# EAGLE design Apogee (EAGLE 9.6.2)
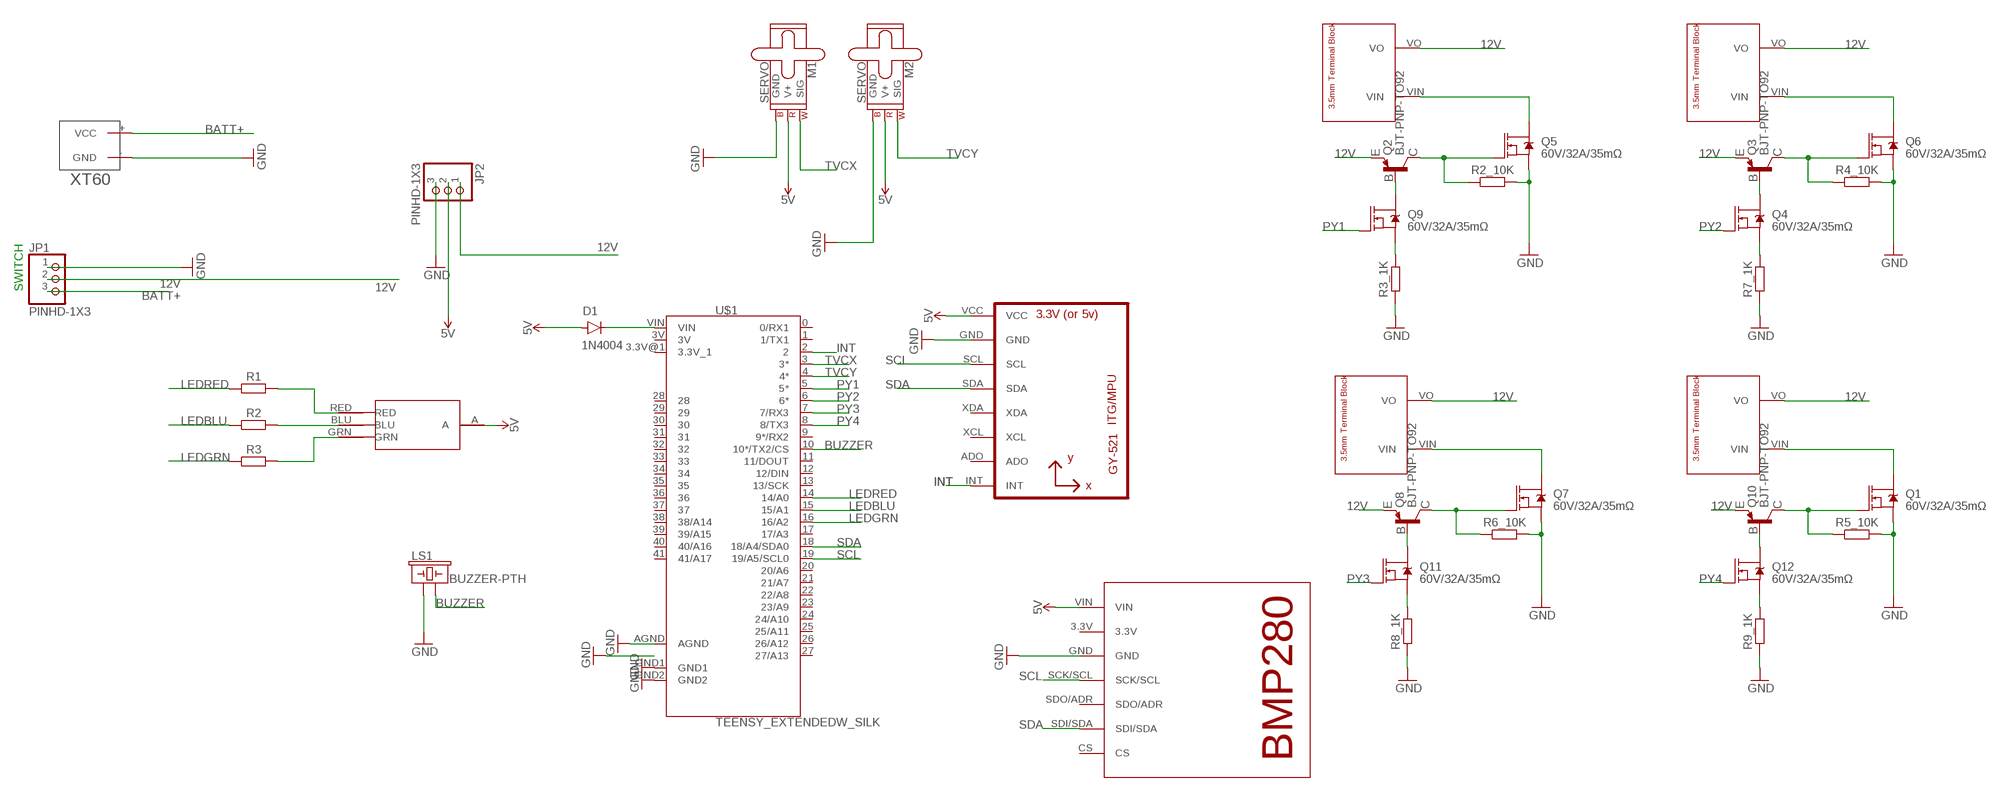
[diagram p0: schematic, sheet 1]

## Parts
D1  1N4004  [DO-41]
JP1  PINHD-1X3  [1X03]
JP2  PINHD-1X3  [1X03]
LS1  BUZZER-PTH  [BUZZER-12MM]
M1  SERVO  [1X03]
M2  SERVO  [1X03]
Q1  60V/32A/35mΩ  MOSFET-NCH-FQP30N06L  [TO220V]
Q2  BJT-PNP-TO92  [TO92]
Q3  BJT-PNP-TO92  [TO92]
Q4  60V/32A/35mΩ  MOSFET-NCH-FQP30N06L  [TO220V]
Q5  60V/32A/35mΩ  MOSFET-NCH-FQP30N06L  [TO220V]
Q6  60V/32A/35mΩ  MOSFET-NCH-FQP30N06L  [TO220V]
Q7  60V/32A/35mΩ  MOSFET-NCH-FQP30N06L  [TO220V]
Q8  BJT-PNP-TO92  [TO92]
Q9  60V/32A/35mΩ  MOSFET-NCH-FQP30N06L  [TO220V]
Q10  BJT-PNP-TO92  [TO92]
Q11  60V/32A/35mΩ  MOSFET-NCH-FQP30N06L  [TO220V]
Q12  60V/32A/35mΩ  MOSFET-NCH-FQP30N06L  [TO220V]
R1  R_AXIAL-7.2MM-PITCH  [RESAD724W46L381D178B]
R2  R_AXIAL-7.2MM-PITCH  [RESAD724W46L381D178B]
R2_10K  R_AXIAL-7.2MM-PITCH  [RESAD724W46L381D178B]
R3  R_AXIAL-7.2MM-PITCH  [RESAD724W46L381D178B]
R3_1K  R_AXIAL-7.2MM-PITCH  [RESAD724W46L381D178B]
R4_10K  R_AXIAL-7.2MM-PITCH  [RESAD724W46L381D178B]
R5_10K  R_AXIAL-7.2MM-PITCH  [RESAD724W46L381D178B]
R6_10K  R_AXIAL-7.2MM-PITCH  [RESAD724W46L381D178B]
R7_1K  R_AXIAL-7.2MM-PITCH  [RESAD724W46L381D178B]
R8_1K  R_AXIAL-7.2MM-PITCH  [RESAD724W46L381D178B]
R9_1K  R_AXIAL-7.2MM-PITCH  [RESAD724W46L381D178B]
U1  GY-521MPU6050  [GY-521]
U$1  TEENSY_EXTENDEDW_SILK  [TEENSY_EXTENDED]
U$2  BMP280  [BMP280]
U$3  XT60  [XT60]
U$4  TERMINALBLOCK  [TERMINALBLOCK]
U$5  LEDCA  [LEDCA]
U$6  TERMINALBLOCK  [TERMINALBLOCK]
U$9  TERMINALBLOCK  [TERMINALBLOCK]
U$10  TERMINALBLOCK  [TERMINALBLOCK]

## Nets
5V: D1.A JP2.2 M1.2(V+) M2.2(V+) U1.VCC U$2.VIN U$5.A
12V: JP1.2 JP2.1 Q2.3(E) Q3.3(E) Q8.3(E) Q10.3(E) U$4.VO U$6.VO U$9.VO U$10.VO
BATT+: JP1.3 U$3.+(VCC)
BUZZER: LS1.- U$1.10(10*/TX2/CS)
GND: JP1.1 JP2.3 LS1.+ M1.3(GND) M2.3(GND) Q1.3(S) Q5.3(S) Q6.3(S) Q7.3(S) R2_10K.2 R3_1K.1 R4_10K.2 R5_10K.2 R6_10K.2 R7_1K.1 R8_1K.1 R9_1K.1 U1.GND U$1.GND1 U$1.GND2 U$2.GND U$3.-(GND)
INT: U1.INT U$1.2
LEDBLU: R2.1 U$1.15(15/A1)
LEDGRN: R3.1 U$1.16(16/A2)
LEDRED: R1.1 U$1.14(14/A0)
N$1: R3.2 U$5.GRN
N$2: R2.2 U$5.BLU
N$3: R1.2 U$5.RED
N$4: Q1.2(D) U$4.VIN
N$5: D1.C U$1.VIN
N$6: U$1.AGND ; supply symbol labelled GND
N$8: Q5.2(D) U$6.VIN
N$9: Q2.2(B) Q9.2(D)
N$10: Q6.2(D) U$9.VIN
N$13: Q7.2(D) U$10.VIN
N$14: Q9.3(S) R3_1K.2
N$15: Q7.1(G) Q8.1(C) R6_10K.1
N$16: Q2.1(C) Q5.1(G) R2_10K.1
N$17: Q1.1(G) Q10.1(C) R5_10K.1
N$18: Q3.1(C) Q6.1(G) R4_10K.1
N$19: Q11.3(S) R8_1K.2
N$20: Q12.3(S) R9_1K.2
N$21: Q4.3(S) R7_1K.2
N$22: Q3.2(B) Q4.2(D)
N$23: Q8.2(B) Q11.2(D)
N$24: Q10.2(B) Q12.2(D)
PY1: Q9.1(G) U$1.5(5*)
PY2: Q4.1(G) U$1.6(6*)
PY3: Q11.1(G) U$1.7(7/RX3)
PY4: Q12.1(G) U$1.8(8/TX3)
SCL: U1.SCL U$1.19(19/A5/SCL0) U$2.SCK/SCL
SDA: U1.SDA U$1.18(18/A4/SDA0) U$2.SDI/SDA
TVCX: M1.1(SIG) U$1.3(3*)
TVCY: M2.1(SIG) U$1.4(4*)
Unconnected: U1.ADO U1.XCL U1.XDA U$1.0(0/RX1) U$1.1(1/TX1) U$1.9(9*/RX2) U$1.11(11/DOUT) U$1.12(12/DIN) U$1.13(13/SCK) U$1.17(17/A3) U$1.20(20/A6) U$1.21(21/A7) U$1.22(22/A8) U$1.23(23/A9) U$1.24(24/A10) U$1.25(25/A11) U$1.26(26/A12) U$1.27(27/A13) U$1.28 U$1.29 U$1.30 U$1.31 U$1.32 U$1.33 U$1.34 U$1.35 U$1.36 U$1.37 U$1.38(38/A14) U$1.39(39/A15) U$1.40(40/A16) U$1.41(41/A17) U$2.3.3V U$2.CS U$2.SDO/ADR

## Notes on the sheet
- SWITCH

## Power pins joined to a net without a drawn wire
3.3V_1: U$1.3.3V@1(3.3V_1)
3V: U$1.3V

## Library data of the parts
D1 = Diodes:1N4004: DIODE GEN PURP 400V 1A DO41 Manufacturer's datasheet <https://www.mccsemi.com/pdf/Products/1N4001-1N4007(DO-41).pdf>; CREATED_BY: PCBLayout.com; DIGIKEY_PART_NUMBER: 1N4004MSCT-ND; MANUFACTURER: Micro Commercial Co; MPN: 1N4004; PACKAGE: DO-41
JP1 JP2 = SwitchROBIN:PINHD-1X3: PIN HEADER; CATEGORY: CONNECTOR; SUB-CATEGORY: PIN-HEADER
LS1 = SparkFun-Electromechanical:BUZZER: Buzzer Small round buzzers that operate around the audible 2kHz range. You can use these as speakers to create simple music or user interfaces. Variant Overview: PTH - Mini Speaker - PC Mount 12mm 2.048kHz <https://www.sparkfun.com/products/7950> PTH_KIT - Mini Speaker - PC Mount 12mm 2.048kHz <https://www.sparkfun.com/products/7950> KIT simplifies soldering by adding stop mask to one side of the pads. PTH_NO_SILK - Mini Speaker - PC Mount 12mm 2.048kHz <https://www.sparkfun.com/products/7950> No silkscreen indicator of buzzer outline. PTH_KIT_NO_SILK - Mini Speaker - PC Mount 12mm 2.048kHz <https://www.sparkfun.com/products/7950> KIT package w/o silkscreen SMD - Buzzer Audio Magnetic (CCV-084B16) SMD buzzer used on, e.g. the LilyPad Buzzer <https://www.sparkfun.com/products/8463> and RFID USB Reader <https://www.sparkfun.com/products/9963>. SMD_KIT - Buzzer Audio Magnetic (CCV-084B16) SMD Buzzer with elongated pins to make soldering easier. Used on the SparkFun Simon Says - Surface Mount Soldering Kit <https://www.sparkfun.com/products/10935>.; PROD_ID: COMP-08253; SF_SKU: COM-07950
M1 M2 = SparkFun-Electromechanical:SERVO: Servo Motor 3-pin connector for a standard servo motor (voltage supply, ground, and control signal.) SparkFun Products Servo - Generic (Sub-Micro Size) <https://www.sparkfun.com/products/9065> (ROB-09065) Servo - Generic High Torque Continuous Rotation (Standard Size) <https://www.sparkfun.com/products/9347> (ROB-09347) Servo - Generic High Torque (Standard Size) <https://www.sparkfun.com/products/11965> (ROB-11965)
Q1 Q4-Q7 Q9 Q11 Q12 = SparkFun-DiscreteSemi:MOSFET-NCH: N-channel MOSFETs Voltage controlled devices that allow control of high current outputs. SparkFun Products: SparkFun OpenScale <https://www.sparkfun.com/products/13261> SparkFun Digital Sandbox <https://www.sparkfun.com/products/12651> SparkFun Monster Moto Shield <https://www.sparkfun.com/products/10182> SparkFun MOSFET Power Controller <https://www.sparkfun.com/products/11214>; PROD_ID: TRANS-10060
Q2 Q3 Q8 Q10 = bt_transistor:BJT-PNP: PNP Transistor Small signal PNP Bipolar Junction Transistor (BJT). Use this device to represent any of a number of such transistors with similar package and pinout: 2N4402, 2N3906, etc.
R1 R2 R2_10K R3 R3_1K R4_10K R5_10K R6_10K R7_1K R8_1K R9_1K = Resistor AHHH3:R: Resistor Fixed - Generic; CATEGORY: Resistor; SUB-CATEGORY: Fixed
U1 = gy-521:GY-521
U$1 = SparkFun-Boards:TEENSY_EXTENDED: Teensy Footprint Extended Mechanical footprint with connectors for Teensy Development Board with ARM Cortex. SparkFun Products: Teensy 4.1 <https://www.sparkfun.com/products/16771> Teensy 3.6 <https://www.sparkfun.com/products/14057> Teensy 3.5 <https://www.sparkfun.com/products/14055> SparkFun Qwiic Shield for Teensy Extended <https://www.sparkfun.com/products/17156> Teensy Stackable Header Kit (Longer Version) <https://www.sparkfun.com/products/17152>
U$2 = BMP280:BMP280
U$3 = XT60:XT60: XT60
U$4 U$6 U$9 U$10 = Terminal Block 2 pins 3.5mm:TERMINALBLOCK
U$5 = LEDCA:LEDCA

## Board
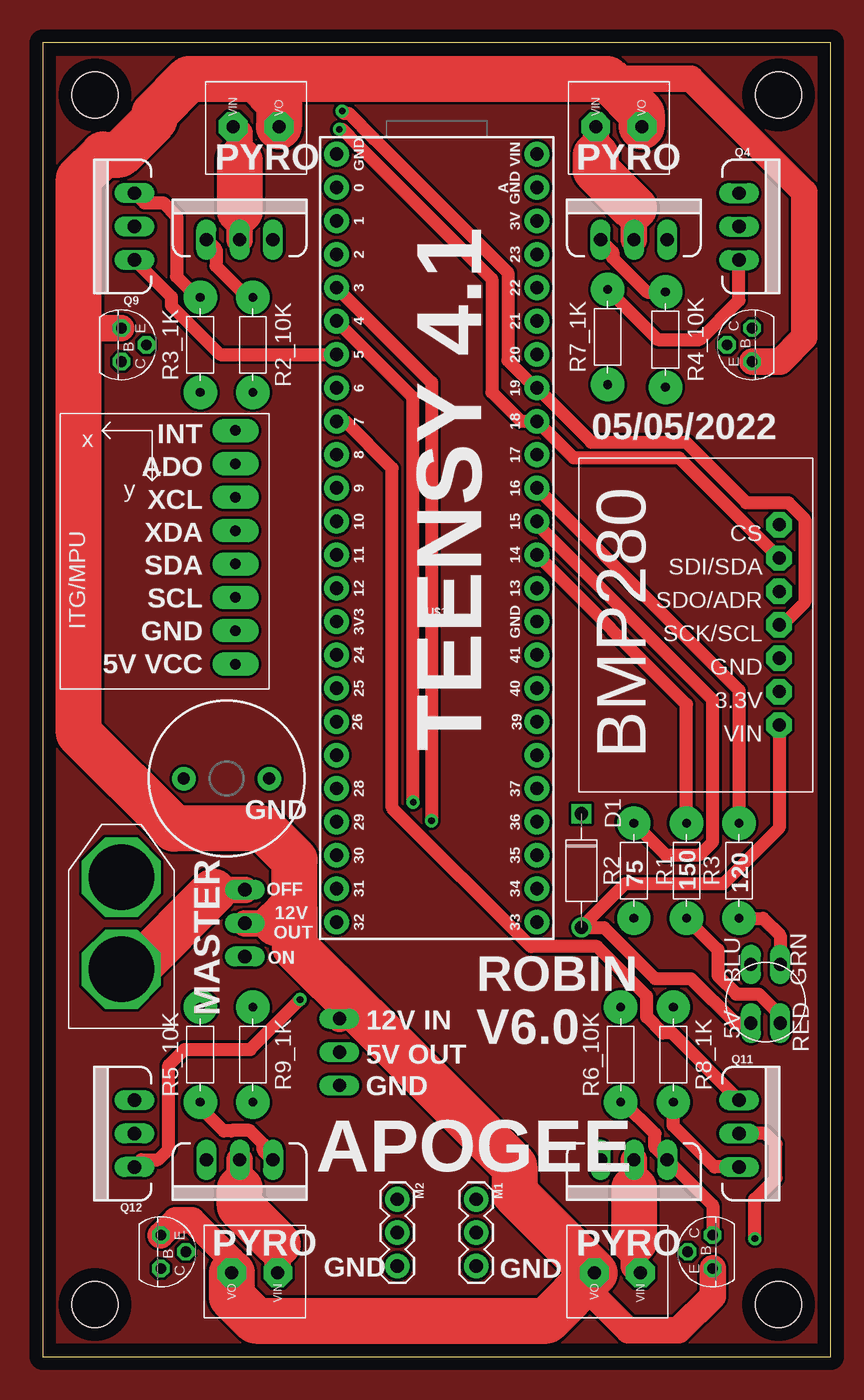
[diagram p1: board, top side]
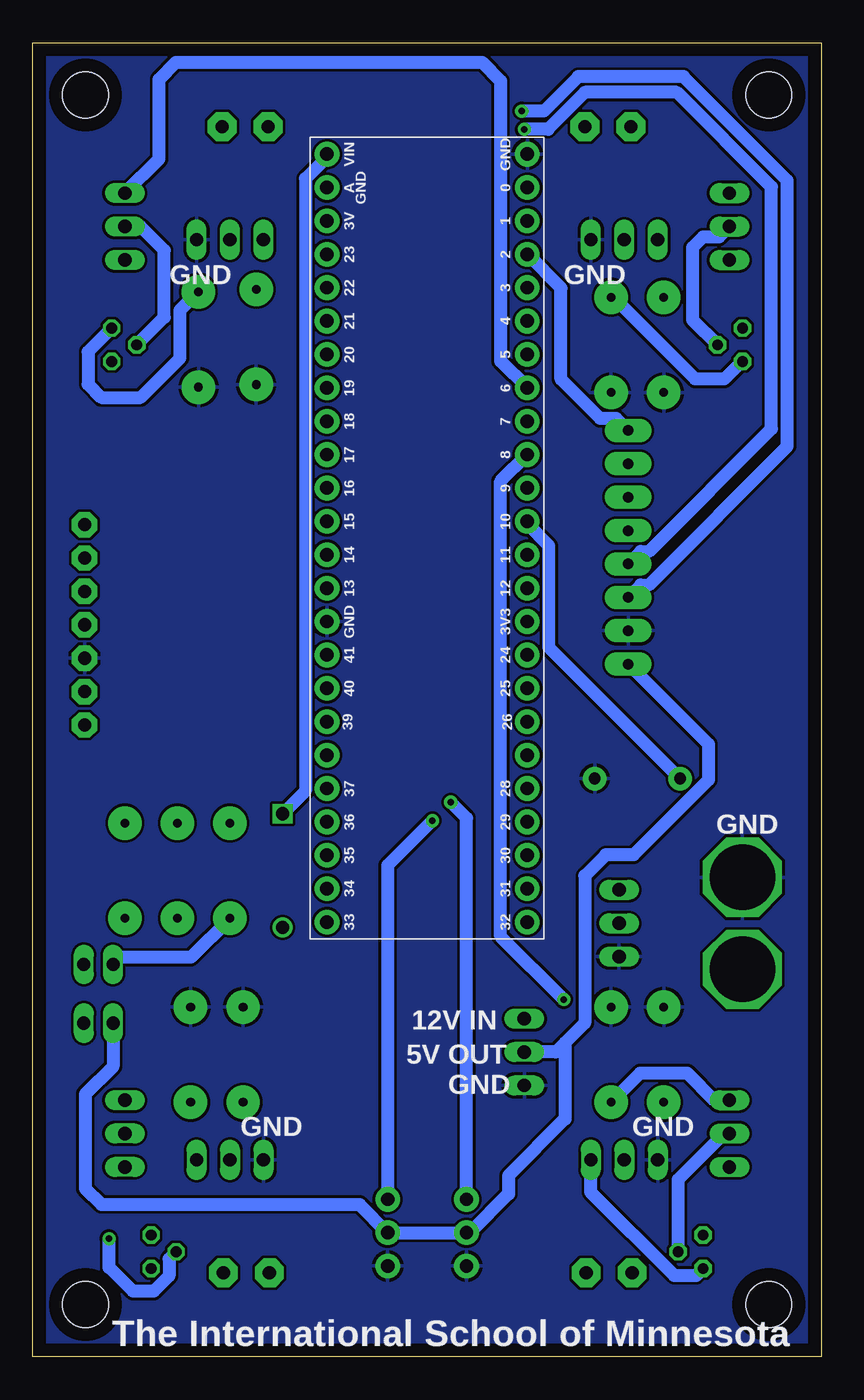
[diagram p2: board, bottom side, seen from below]

Size 60 x 100 mm. Coordinates in mm from the lower left corner, seen from the top.
Outline: 0,100 0,0 60,0 60,100 0,100
Copper layers (1*16): Top 0.035mm / dielectric 1.5mm / Bottom 0.035mm
Design rules "default *": minimum track width 6mil, minimum drill 0.3mm, track to track 8mil, track to pad 8mil, pad to pad 6mil, via to via 6mil, smd to smd 6mil, copper to edge 40mil, drill to drill 6mil, minimum pad ring 10mil, minimum via ring 8mil, stop-mask expansion 4mil, vias tented up to drill 0mil, thermal gap 10mil
Holes 3.5 mm at 4,4 56,4 4,96 56,96

### Footprints (pad centres in the part's own frame; a part is rotated, then mirrored left to right if it is on the bottom)
DO-41 = drill 1: A 4.325,0 | drill 1 square: C -4.325,0
1X03 = drill 1.016 long: 1 -2.54,0; 2 0,0; 3 2.54,0
BUZZER-12MM = drill 0.9 pad 1.778: + 3.25,0; - -3.25,0
1X03' = drill 1.016 pad 1.88: 1 0,0; 2 2.54,0; 3 5.08,0
TO220V = drill 1.016 long: 1 -2.54,0; 2 0,0; 3 2.54,0
TO92 = drill 0.813 octagon: 1 1.27,0; 2 0,1.905; 3 -1.27,0
RESAD724W46L381D178B = drill 0.66 pad 2.54: 1 -3.62,0; 2 3.62,0
GY-521 = drill 0.8 pad 1.778 long: ADO -8.89,-6.35; GND -8.89,6.35; INT -8.89,-8.89; SCL -8.89,3.81; SDA -8.89,1.27; VCC -8.89,8.89; XCL -8.89,-3.81; XDA -8.89,-1.27
TEENSY_EXTENDED = drill 1.016 pad 1.88: 0 7.62,-13.97; 1 7.62,-11.43; 2 7.62,-8.89; 3 7.62,-6.35; 3.3V@1 7.62,19.05; 3V -7.62,-11.43; 4 7.62,-3.81; 5 7.62,-1.27; 6 7.62,1.27; 7 7.62,3.81; 8 7.62,6.35; 9 7.62,8.89; 10 7.62,11.43; 11 7.62,13.97; 12 7.62,16.51; 13 -7.62,16.51; 14 -7.62,13.97; 15 -7.62,11.43; 16 -7.62,8.89; 17 -7.62,6.35; 18 -7.62,3.81; 19 -7.62,1.27; 20 -7.62,-1.27; 21 -7.62,-3.81; 22 -7.62,-6.35; 23 -7.62,-8.89; 24 7.62,21.59; 25 7.62,24.13; 26 7.62,26.67; 27 7.62,29.21; 28 7.62,31.75; 29 7.62,34.29; 30 7.62,36.83; 31 7.62,39.37; 32 7.62,41.91; 33 -7.62,41.91; 34 -7.62,39.37; 35 -7.62,36.83; 36 -7.62,34.29; 37 -7.62,31.75; 38 -7.62,29.21; 39 -7.62,26.67; 40 -7.62,24.13; 41 -7.62,21.59; AGND -7.62,-13.97; GND1 7.62,-16.51; GND2 -7.62,19.05; VIN -7.62,-16.51
BMP280 = drill 1 pad 1.93 octagon: 3.3V 7.62,2.54; CS 20.32,2.54; GND 10.16,2.54; SCK/SCL 12.7,2.54; SDI/SDA 17.78,2.54; SDO/ADR 15.24,2.54; VIN 5.08,2.54
XT60 = drill 5 octagon: + 4.5,0; - 11.5,0
TERMINALBLOCK = drill 1 pad 2.184 octagon: VIN 2.1,3.6; VO 5.6,3.6
LEDCA = drill 1 long: A -1.1,-1.6; BLU -1.1,2.87; GRN 1.13,2.87; RED 1.13,-1.6

### Placement (x,y rotation side)
D1  41,37 270 top
JP1  15.4,33 90 top
JP2  22.6,23.2 270 top
LS1  14,44 0 top
M1  SERVO  [1X03']  33,12 270 top
M2  SERVO  [1X03']  27,12 270 top
Q1  15,15 180 top
Q2  6,77 270 top
Q3  54,77 90 top
Q4  53,86 270 top
Q5  15,85 0 top
Q6  45,85 0 top
Q7  45,15 180 top
Q8  51,8 90 top
Q9  7,86 90 top
Q10  9,8 270 top
Q11  53,17 270 top
Q12  7,17 90 top
R1  49,37 270 top
R2  45,37 270 top
R2_10K  16,77 270 top
R3  53,37 270 top
R3_1K  12,77 90 top
R4_10K  47.4,77.4 270 top
R5_10K  12,23 90 top
R6_10K  44,23 90 top
R7_1K  43,77.6 90 top
R8_1K  48,23 270 top
R9_1K  16,23 270 top
U1  5.8,61.6 180 top
U$1  30,75 180 top
U$2  58.6,43 90 top
U$3  6,25 90 top
U$4  20,10 180 top
U$5  55,27 0 top
U$6  12.4,90 0 top
U$9  40,90 0 top
U$10  47.6,10 180 top

### Tracks (layer width: path | path; a pad name or v marks a point on that pad's centre or on a via)
3.3V
  pour Top: -6,104 65.8,104 65.8,-5 -3,-5 -6,-2
5V
  Top 1: U$5.A 52.7,25.4 49.3,28.8 46.6,28.8 42.73,32.67 D1.A 44.33,36 51.8,36 56.06,40.26 U$2.VIN
  Bottom 1: U$5.A 53.9,22.1 56,20 56,12.8 54.8,11.6 35.14,11.6 M1.2 M2.2 26.74,9.46 23.8,12.4 23.8,13.8 19.5,18.1 19.5,23.9 | U1.VCC 8.6,46.62 8.6,43.9 14.3,38.2 16.4,38.2 18,36.6 18,25.4 19.5,23.9 | JP2.2 20.2,23.2 19.5,23.9
12V
  Top 2: Q10.3 10.13,10.4 11.4,10.4 14.4,7.4 U$4.VO | Q8.3 51,4.62 48.4,2.02 44.58,2.02 42,4.6 U$10.VO | 2.77,78.2 2.84,78.27 Q2.3 | Q3.3 56.13,75.73 57.98,77.58 57.98,88.6 49.35,97.23 42.97,97.23 | JP1.2 17.8,33 | JP2.1 22.77,25.91 24.49,25.91
  Top 3.5: U$4.VO 14.4,4.57 16.2,2.77 38.37,2.77 U$10.VO 35.89,12.51 35.89,14.51 24.49,25.91 19.2,31.2 19.2,34 | 16.2,97.23 18,95.43 U$6.VO | 16.2,97.23 11.15,97.23 8.52,94.6 8.52,94.13 5.87,91.48 4.6,91.48 2.77,89.65 2.77,78.2 2.77,47.43 10,40.2 16.8,40.2 19.2,37.8 19.2,34 | U$9.VO 45.6,94.6 42.97,97.23 16.2,97.23 | 17.8,33 19,34.2 19.2,34
BATT+
  Top 2: JP1.3 13,35.54 13,35.4
  Top 3.5: 13,35.4 7.1,29.5 U$3.+
BUZZER
  Bottom 1: LS1.- 20.74,53.99 20.74,61.71 22.38,63.35 U$1.10
GND
  pour Bottom: -2,101 63,101 63,-3 -3,-3 -5,-1 -5,98
INT
  Bottom 1: U1.INT 15.61,71.41 16.82,71.41 19.8,74.39 19.8,81.31 U$1.2
LEDBLU
  Top 1: R2.1 47.42,38.2 50,38.2 51,39.2 51,50 37.62,63.38 U$1.15
LEDGRN
  Top 1: U$1.16 53,50.73 R3.1
LEDRED
  Top 1: R1.1 49,49.65 U$1.14
N$1
  Top 1: R3.2 54.82,33.38 56.13,32.07 U$5.GRN
N$2
  Bottom 1: R2.2 47.98,30.4 53.37,30.4 U$5.BLU
N$3
  Top 1: R1.2 51.4,30.98 51.4,29 52.79,27.61 54.5,27.61 56.13,25.98 U$5.RED
N$4
  Top 2: 15,12.8 Q1.2 | U$4.VIN 17.9,8.6
  Top 3.5: 17.9,8.6 15,11.5 15,12.8
N$5
  Bottom 1: D1.C 39.26,43.06 39.26,89.65 37.62,91.29 U$1.VIN
N$8
  Top 2: U$6.VIN 15,93.1 15,91 | 15,87.2 Q5.2
  Top 3.5: 15,91 15,87.2
N$9
  Bottom 1: Q9.2 7.8,85.2 9,85.2 9.8,84.4 9.8,78.89 Q2.2
N$10
  Top 2: 42.1,91.4 U$9.VIN | 45,87.4 Q6.2
  Top 3.5: 45,87.4 42.1,90.3 42.1,91.4
N$13
  Top 2: Q7.2 45,12.8 | 45,8.8 45,6.9 U$10.VIN
  Top 3.5: 45,12.8 45,8.8
N$14
  Top 1: Q9.3 7.74,87.8 9.2,87.8 10.2,86.8 10.2,82.2 11.78,80.62 R3_1K.2
N$15
  Top 1: R6_10K.1 44.22,19.38 46.6,17 46.6,15.94 Q7.1 51,11.54 Q8.1
N$16
  Top 1: Q5.1 13.2,84.26 13.2,83 15.58,80.62 R2_10K.1
  Bottom 1: Q2.1 6.07,75.73 7.4,74.4 9.6,74.4 15.82,80.62 R2_10K.1
N$17
  Top 1: Q1.1 16.8,15.74 16.8,16.2 15.77,17.23 14.39,17.23 14.37,17.2 13.8,17.2 12,19 R5_10K.1
  Bottom 1: Q10.1 9.53,6.2 11.2,6.2 17.54,12.54 Q1.1
N$18
  Top 1: Q6.1 43.4,84.06 43.4,83.61 45.99,81.02 R4_10K.1
  Bottom 1: Q3.1 55.8,76.47 55.8,74 54.8,73 51.8,73 48.8,76 48.8,78.59 48.8,78.6 48.8,79.62 R4_10K.1
N$19
  Top 1: Q11.3 51.14,14.46 48,17.6 R8_1K.2
N$20
  Bottom 1: R9_1K.2 13.78,21.6 10.2,21.6 8.14,19.54 Q12.3
N$21
  Top 1: R7_1K.2 46.82,77.4 50,77.4 53,80.4 Q4.3
N$22
  Bottom 1: Q3.2 50,79.09 50,84.2 51.8,86 Q4.2
N$23  (via drill 0.5 pad 1)
  Top 1: v54.2,9 54.2,12 55.8,13.6 55.8,16.2 55,17 Q11.2
  Bottom 1: Q8.2 49.64,7.46 49.64,6.17 50.8,5 52.38,5 54.2,6.82 v54.2,9
N$24
  Bottom 1: Q12.2 7.4,17 10.9,13.49 Q10.2
PY1
  Top 1: Q9.1 9.8,80.66 9.8,80 13.53,76.27 U$1.5
PY2
  Bottom 1: Q4.1 50.4,91.14 50.4,97.2 49.12,98.48 25.8,98.48 24.4,97.08 24.4,75.75 U$1.6
PY3
  Top 1: Q11.1 47.89,24.65 47.18,24.65 45.97,25.86 45.97,27.44 42.19,31.22 37.17,31.22 26.6,41.79 26.6,67.6 23.01,71.19 U$1.7
PY4  (via drill 0.5 pad 1)
  Top 1: Q12.1 7.54,15 8.8,15 9.6,15.8 9.6,22.2 10.8,23.4 15.8,23.4 v19.6,27.2
  Bottom 1: v19.6,27.2 24.4,32 24.4,66.63 U$1.8
SCL  (via drill 0.5 pad 1)
  Top 1: U$2.SCK/SCL 56.3,55.7 58,57.4 58,63.74 56.75,64.99 53.55,64.99 48.95,69.59 41.76,69.59 U$1.19 37.47,73.73 35.4,75.8 35.4,82.5 25.23,92.67 25.23,92.69 23.31,94.6 22.98,94.6 v22.8,94.78
  Bottom 1: U1.SCL 13.74,58.74 13.14,58.74 2.6,69.28 2.6,89.5 10.5,97.4 18.5,97.4 21.12,94.78 v22.8,94.78
SDA  (via drill 0.5 pad 1)
  Top 1: U$2.SDI/SDA 48.45,68.39 40.42,68.39 U$1.18 36.41,71.19 34.2,73.4 34.2,82 24.02,92.18 24.02,92.19 22.81,93.4 v22.6,93.4
  Bottom 1: U1.SDA 13.74,61.28 13.14,61.28 3.8,70.62 3.8,89 11,96.2 18,96.2 20.8,93.4 v22.6,93.4
TVCX  (via drill 0.5 pad 1)
  Top 1: U$1.3 29.6,74.13 v29.6,40.8
  Bottom 1: v29.6,40.8 33,37.4 M1.1
TVCY  (via drill 0.5 pad 1)
  Top 1: v28.2,42.2 28.2,72.99 U$1.4
  Bottom 1: M2.1 27,41 v28.2,42.2

### Text on the board
tPlace: PYRO | PYRO | INT | 05/05/2022 | ADO | XCL | XDA | SDA | SCL | GND | 5V VCC | TEENSY 4.1 | GND | 150 | MASTER | 75 | 120 | OFF | 12V / OUT | ON | 12V IN | ROBIN / V6.0 | 5V OUT | GND | APOGEE | PYRO | PYRO | GND | GND
bPlace: GND | GND | GND | 12V IN | 5V OUT | GND | GND | GND | The International School of Minnesota